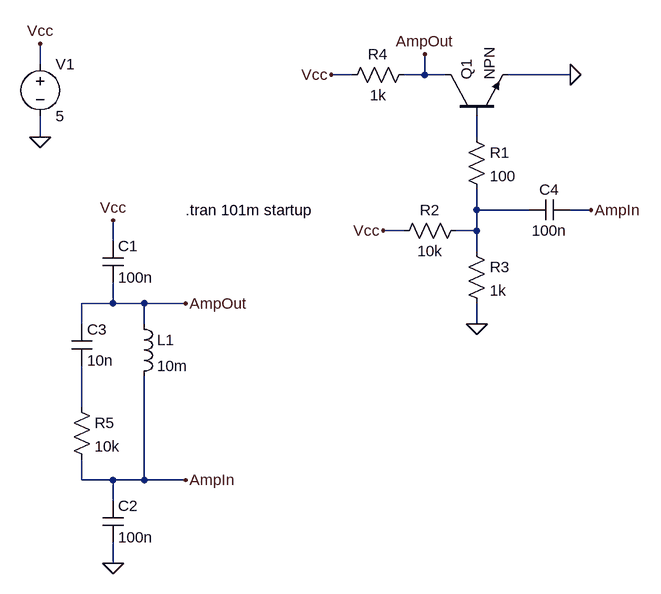
[diagram p0: schematic LCTankOscillator-v2.asc]
LCTankOscillator-v2.asc, the LTspice schematic file:
Version 4
SHEET 1 880 900
WIRE -512 112 -512 80
WIRE -32 128 -64 128
WIRE 80 128 80 96
WIRE 80 128 48 128
WIRE 112 128 80 128
WIRE 304 128 208 128
WIRE -512 224 -512 192
WIRE 160 224 160 192
WIRE 160 336 160 304
WIRE 240 336 160 336
WIRE 336 336 304 336
WIRE 48 368 16 368
WIRE 160 368 160 336
WIRE 160 368 128 368
WIRE -400 384 -400 352
WIRE 160 400 160 368
WIRE -400 480 -400 448
WIRE -400 480 -448 480
WIRE -352 480 -400 480
WIRE -288 480 -352 480
WIRE -448 512 -448 480
WIRE -352 512 -352 480
WIRE 160 512 160 480
WIRE -448 640 -448 576
WIRE -448 752 -448 720
WIRE -400 752 -448 752
WIRE -352 752 -352 592
WIRE -352 752 -400 752
WIRE -288 752 -352 752
WIRE -400 784 -400 752
WIRE -400 880 -400 848
FLAG 304 128 0
FLAG 160 512 0
FLAG 16 368 Vcc
FLAG -512 80 Vcc
FLAG -64 128 Vcc
FLAG -512 224 0
FLAG 80 96 AmpOut
FLAG 336 336 AmpIn
FLAG -400 880 0
FLAG -400 352 Vcc
FLAG -288 480 AmpOut
FLAG -288 752 AmpIn
SYMBOL npn 112 192 R270
SYMATTR InstName Q1
SYMBOL res 144 208 R0
SYMATTR InstName R1
SYMATTR Value 100
SYMBOL res 32 384 R270
WINDOW 0 32 56 VTop 2
WINDOW 3 0 56 VBottom 2
SYMATTR InstName R2
SYMATTR Value 10k
SYMBOL res 144 384 R0
SYMATTR InstName R3
SYMATTR Value 1k
SYMBOL voltage -512 96 R0
WINDOW 123 0 0 Left 0
WINDOW 39 0 0 Left 0
SYMATTR InstName V1
SYMATTR Value 5
SYMBOL res -48 144 R270
WINDOW 0 32 56 VTop 2
WINDOW 3 0 56 VBottom 2
SYMATTR InstName R4
SYMATTR Value 1k
SYMBOL cap -416 384 R0
SYMATTR InstName C1
SYMATTR Value 100n
SYMBOL cap -416 784 R0
SYMATTR InstName C2
SYMATTR Value 100n
SYMBOL cap -464 512 R0
SYMATTR InstName C3
SYMATTR Value 10n
SYMBOL ind -368 496 R0
SYMATTR InstName L1
SYMATTR Value 10m
SYMBOL cap 304 320 R90
WINDOW 0 0 32 VBottom 2
WINDOW 3 32 32 VTop 2
SYMATTR InstName C4
SYMATTR Value 100n
SYMBOL res -464 624 R0
SYMATTR InstName R5
SYMATTR Value 10k
TEXT -288 336 Left 2 !.tran 101m startup

The netlist it stands for:
* LCTankOscillator-v2.asc
Q1 AmpOut N001 0 0 NPN
R1 N001 N002 100
R2 Vcc N002 10k
R3 N002 0 1k
V1 Vcc 0 5
R4 Vcc AmpOut 1k
C1 Vcc AmpOut 100n
C2 AmpIn 0 100n
C3 AmpOut N003 10n
L1 AmpOut AmpIn 10m
C4 AmpIn N002 100n
R5 N003 AmpIn 10k
.model NPN NPN
.model PNP PNP
.lib standard.bjt
.tran 101m startup
.backanno
.end